# Altium schematic sheet AI_ARTIQ_Driver.SchDoc: AI ARTIQ Driver
size 420 x 297 mm; Author: G.Kasprowicz; CompanyName: CTI; Organization: CTI; Address1: CTI; Address2: Nowowiejska 15/19 00-665 Warsaw; Address3: gkasprow@gmail.com; DocumentNumber: 1; Revision: 1.0; SheetNumber: 1; SheetTotal: 11; ModifiedBy: -; CheckedDate: -; Title2: TOP; DivGrp: CTI; ModifiedDate: -; ProjectName: Sensor Box
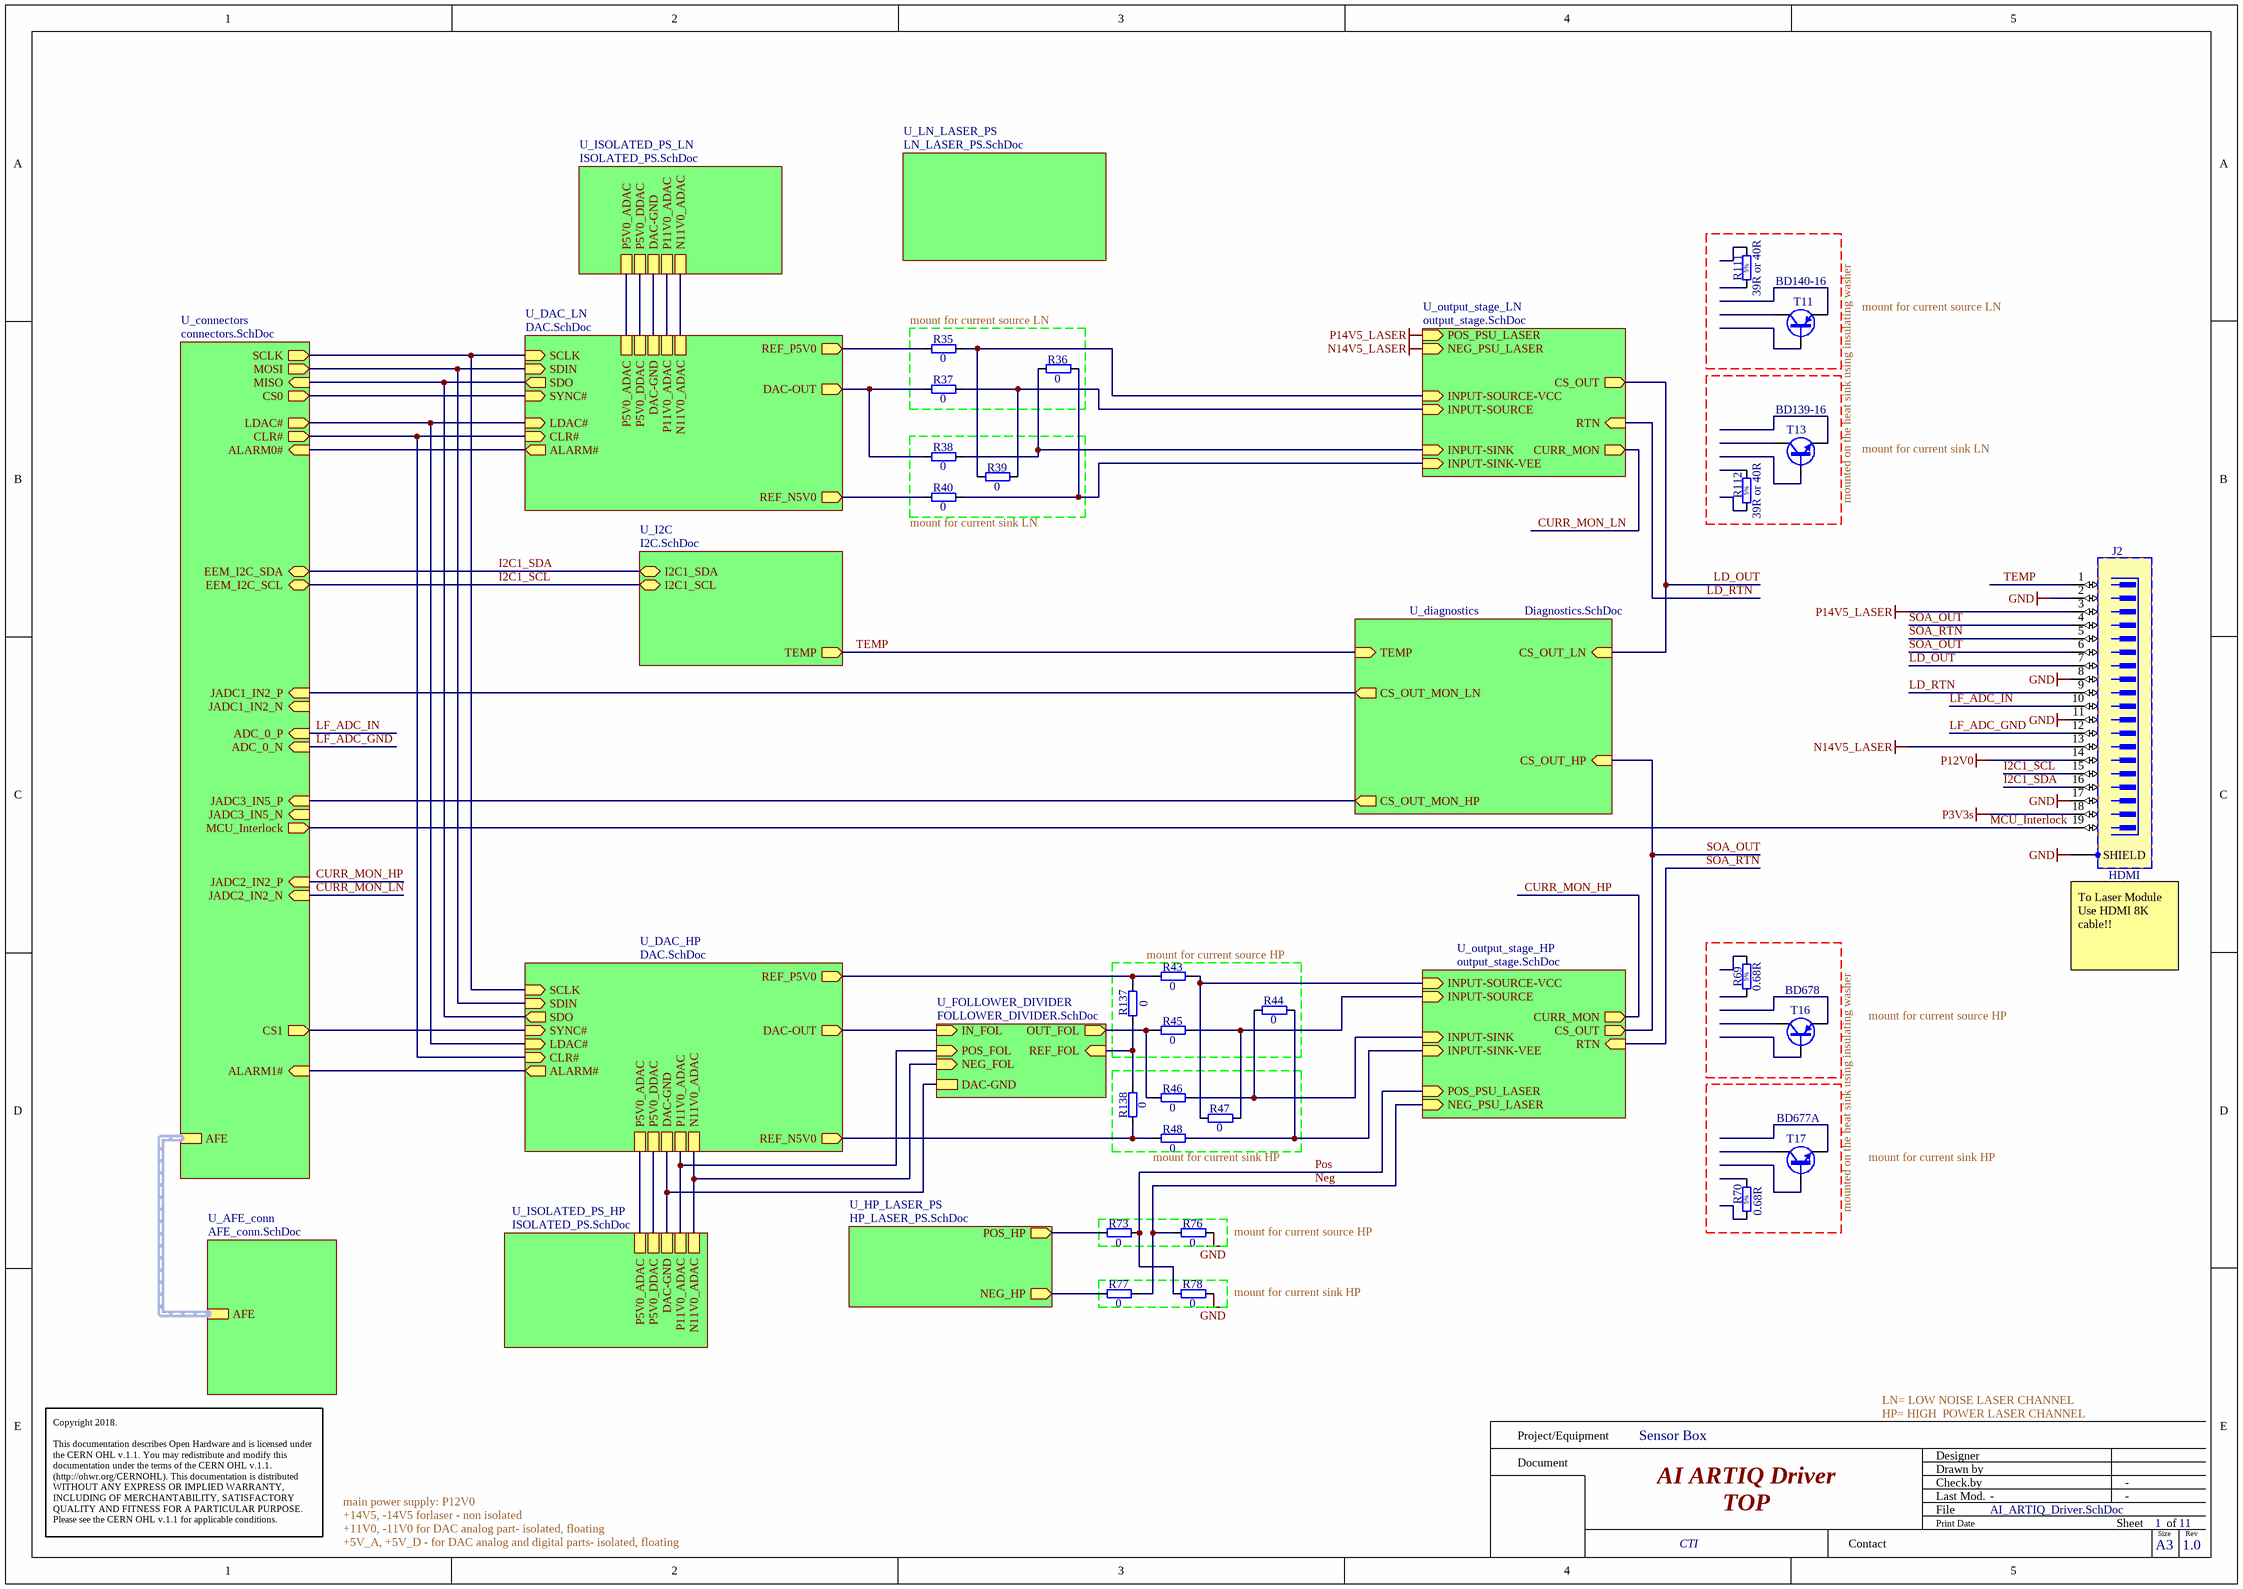
[diagram p0: AI_ARTIQ_Driver.SchDoc]

## Parts
J2  HDMI  [MOLEX_47151-0001]
R35  0  [RESC2012X60N]
R36  0  [RESC2012X60N]
R37  0  [RESC2012X60N]
R38  0  [RESC2012X60N]
R39  0  [RESC2012X60N]
R40  0  [RESC2012X60N]
R43  0  [RESC2012X60N]
R44  0  [RESC2012X60N]
R45  0  [RESC2012X60N]
R46  0  [RESC2012X60N]
R47  0  [RESC2012X60N]
R48  0  [RESC2012X60N]
R69  0.68R  [RES_VISHAY_RTO50F_v]  (mechanical)
R70  0.68R  [RES_VISHAY_RTO50F_v]  (mechanical)
R73  0  [RESC2012X60N]
R76  0  [RESC2012X60N]
R77  0  [RESC2012X60N]
R78  0  [RESC2012X60N]
R111  39R or 40R  [RES_VISHAY_RTO50F_v]  (mechanical)
R112  39R or 40R  [RES_VISHAY_RTO50F_v]  (mechanical)
R137  0  [RESC2012X60N]
R138  0  [RESC2012X60N]
T11  BD140-16  [TO-126-v]  (mechanical)
T13  BD139-16  [TO-126-v]  (mechanical)
T16  BD678  [TO-126-v]  (mechanical)
T17  BD677A  [TO-126-v]  (mechanical)

## Blocks framed on the sheet
mount for current source LN: R35-R37
mount for current source HP: R43-R45 R137

## Sub-sheets
U_AFE_conn = AFE_conn.SchDoc: AFE (harness AFE)
U_connectors = connectors.SchDoc: SCLK (out), MOSI (out), MISO (in), CS0 (out), EEM_I2C_SDA (bidir), EEM_I2C_SCL (bidir), LDAC# (out), CLR# (out), JADC1_IN2_P (in), JADC1_IN2_N (in), JADC3_IN5_P (in), JADC3_IN5_N (in), CS1 (out), ALARM0# (in), ALARM1# (in), AFE (harness AFE), ADC_0_P (in), ADC_0_N (in), MCU_Interlock (out), JADC2_IN2_P (in), JADC2_IN2_N (in)
U_DAC_HP = DAC.SchDoc: DAC-OUT (out), REF_P5V0 (out), REF_N5V0 (out), SCLK (in), SDIN (in), SYNC# (in), SDO (out), LDAC# (in), CLR# (in), ALARM# (out), P5V0_DDAC, DAC-GND, P11V0_ADAC, N11V0_ADAC, P5V0_ADAC
U_DAC_LN = DAC.SchDoc: DAC-OUT (out), REF_P5V0 (out), REF_N5V0 (out), SCLK (in), SDIN (in), SYNC# (in), SDO (out), LDAC# (in), CLR# (in), ALARM# (out), P5V0_DDAC, DAC-GND, P11V0_ADAC, N11V0_ADAC, P5V0_ADAC
U_diagnostics = Diagnostics.SchDoc: CS_OUT_HP (in), CS_OUT_MON_HP (out), CS_OUT_LN (in), CS_OUT_MON_LN (out), TEMP (in)
U_FOLLOWER_DIVIDER = FOLLOWER_DIVIDER.SchDoc: POS_FOL (in), NEG_FOL (in), IN_FOL (in), OUT_FOL (out), REF_FOL (in), DAC-GND
U_HP_LASER_PS = HP_LASER_PS.SchDoc: POS_HP (out), NEG_HP (out)
U_I2C = I2C.SchDoc: TEMP (out), I2C1_SCL (bidir), I2C1_SDA (bidir)
U_ISOLATED_PS_HP = ISOLATED_PS.SchDoc: P5V0_DDAC, DAC-GND, P11V0_ADAC, N11V0_ADAC, P5V0_ADAC
U_ISOLATED_PS_LN = ISOLATED_PS.SchDoc: P5V0_DDAC, DAC-GND, P11V0_ADAC, N11V0_ADAC, P5V0_ADAC
U_LN_LASER_PS = LN_LASER_PS.SchDoc: no entries
U_output_stage_HP = output_stage.SchDoc: INPUT-SOURCE (in), INPUT-SINK (in), INPUT-SOURCE-VCC (in), INPUT-SINK-VEE (in), CS_OUT (out), POS_PSU_LASER (in), NEG_PSU_LASER (in), RTN (in), CURR_MON (out)
U_output_stage_LN = output_stage.SchDoc: INPUT-SOURCE (in), INPUT-SINK (in), INPUT-SOURCE-VCC (in), INPUT-SINK-VEE (in), CS_OUT (out), POS_PSU_LASER (in), NEG_PSU_LASER (in), RTN (in), CURR_MON (out)

## Nets
GND: J2.2 J2.8 J2.11 J2.17 J2.SHIELD R76.2 R78.2
N14V5_LASER: J2.13 ; sheet U_output_stage_LN/NEG_PSU_LASER
P3V3s: J2.18
P12V0: J2.14
P14V5_LASER: J2.3 ; sheet U_output_stage_LN/POS_PSU_LASER
CURR_MON_HP: sheet U_connectors/JADC2_IN2_P, sheet U_output_stage_HP/CURR_MON
CURR_MON_LN: sheet U_output_stage_LN/CURR_MON, sheet U_connectors/JADC2_IN2_N
I2C1_SCL: J2.15 ; sheet U_connectors/EEM_I2C_SCL, sheet U_I2C/I2C1_SCL
I2C1_SDA: J2.16 ; sheet U_connectors/EEM_I2C_SDA, sheet U_I2C/I2C1_SDA
LD_OUT: J2.7 ; sheet U_output_stage_LN/CS_OUT, sheet U_diagnostics/CS_OUT_LN
LD_RTN: J2.9 ; sheet U_output_stage_LN/RTN
LF_ADC_GND: J2.12 ; sheet U_connectors/ADC_0_N
LF_ADC_IN: J2.10 ; sheet U_connectors/ADC_0_P
MCU_Interlock: J2.19 ; sheet U_connectors/MCU_Interlock
Neg: R76.1 R77.2 ; sheet U_output_stage_HP/NEG_PSU_LASER
Pos: R73.2 R78.1 ; sheet U_output_stage_HP/POS_PSU_LASER
SOA_OUT: J2.4 J2.6 ; sheet U_diagnostics/CS_OUT_HP, sheet U_output_stage_HP/CS_OUT
SOA_RTN: J2.5 ; sheet U_output_stage_HP/RTN
TEMP: J2.1 ; sheet U_I2C/TEMP, sheet U_diagnostics/TEMP
NetR35_1: R35.1 ; sheet U_DAC_LN/REF_P5V0
NetR35_2: R35.2 R39.1 ; sheet U_output_stage_LN/INPUT-SOURCE-VCC
NetR36_1: R36.1 R38.2 ; sheet U_output_stage_LN/INPUT-SINK
NetR36_2: R36.2 R40.2 ; sheet U_output_stage_LN/INPUT-SINK-VEE
NetR37_1: R37.1 R38.1 ; sheet U_DAC_LN/DAC-OUT
NetR37_2: R37.2 R39.2 ; sheet U_output_stage_LN/INPUT-SOURCE
NetR40_1: R40.1 ; sheet U_DAC_LN/REF_N5V0
NetR43_1: R43.1 R137.2 ; sheet U_DAC_HP/REF_P5V0
NetR43_2: R43.2 R47.1 ; sheet U_output_stage_HP/INPUT-SOURCE-VCC
NetR44_1: R44.1 R46.2 ; sheet U_output_stage_HP/INPUT-SINK
NetR44_2: R44.2 R48.2 ; sheet U_output_stage_HP/INPUT-SINK-VEE
NetR45_1: R45.1 R46.1 ; sheet U_FOLLOWER_DIVIDER/OUT_FOL
NetR45_2: R45.2 R47.2 ; sheet U_output_stage_HP/INPUT-SOURCE
NetR48_1: R48.1 R138.1 ; sheet U_DAC_HP/REF_N5V0
NetR73_1: R73.1 ; sheet U_HP_LASER_PS/POS_HP
NetR77_1: R77.1 ; sheet U_HP_LASER_PS/NEG_HP
NetR137_1: R137.1 R138.2 ; sheet U_FOLLOWER_DIVIDER/REF_FOL
(unnamed): sheet U_DAC_LN/SCLK, sheet U_connectors/SCLK, sheet U_DAC_HP/SCLK
(unnamed): sheet U_DAC_LN/SDIN, sheet U_connectors/MOSI, sheet U_DAC_HP/SDIN
(unnamed): sheet U_DAC_LN/SYNC#, sheet U_connectors/CS0
(unnamed): sheet U_DAC_LN/SDO, sheet U_connectors/MISO, sheet U_DAC_HP/SDO
(unnamed): sheet U_DAC_LN/LDAC#, sheet U_connectors/LDAC#, sheet U_DAC_HP/LDAC#
(unnamed): sheet U_DAC_LN/CLR#, sheet U_connectors/CLR#, sheet U_DAC_HP/CLR#
(unnamed): sheet U_DAC_LN/ALARM#, sheet U_connectors/ALARM0#
(unnamed): sheet U_DAC_LN/P5V0_DDAC, sheet U_ISOLATED_PS_LN/P5V0_DDAC
(unnamed): sheet U_DAC_LN/DAC-GND, sheet U_ISOLATED_PS_LN/DAC-GND
(unnamed): sheet U_DAC_LN/P11V0_ADAC, sheet U_ISOLATED_PS_LN/P11V0_ADAC
(unnamed): sheet U_DAC_LN/N11V0_ADAC, sheet U_ISOLATED_PS_LN/N11V0_ADAC
(unnamed): sheet U_DAC_LN/P5V0_ADAC, sheet U_ISOLATED_PS_LN/P5V0_ADAC
(unnamed): sheet U_connectors/JADC1_IN2_P, sheet U_diagnostics/CS_OUT_MON_LN
(unnamed): sheet U_connectors/JADC3_IN5_P, sheet U_diagnostics/CS_OUT_MON_HP
(unnamed): sheet U_connectors/CS1, sheet U_DAC_HP/SYNC#
(unnamed): sheet U_connectors/ALARM1#, sheet U_DAC_HP/ALARM#
(unnamed): sheet U_DAC_HP/DAC-OUT, sheet U_FOLLOWER_DIVIDER/IN_FOL
(unnamed): sheet U_DAC_HP/P5V0_DDAC, sheet U_ISOLATED_PS_HP/P5V0_DDAC
(unnamed): sheet U_DAC_HP/DAC-GND, sheet U_ISOLATED_PS_HP/DAC-GND, sheet U_FOLLOWER_DIVIDER/DAC-GND
(unnamed): sheet U_DAC_HP/P11V0_ADAC, sheet U_ISOLATED_PS_HP/P11V0_ADAC, sheet U_FOLLOWER_DIVIDER/POS_FOL
(unnamed): sheet U_DAC_HP/N11V0_ADAC, sheet U_ISOLATED_PS_HP/N11V0_ADAC, sheet U_FOLLOWER_DIVIDER/NEG_FOL
(unnamed): sheet U_DAC_HP/P5V0_ADAC, sheet U_ISOLATED_PS_HP/P5V0_ADAC

Not connected (* = marked no-connect by the designer): R69 1 2; R70 1 2; R111 1 2; R112 1 2; T11 1(E) 2(C) 3(B); T13 1(E) 2(C) 3(B); T16 1(E) 2(C) 3(B); T17 1(E) 2(C) 3(B)

## Buses and harness runs
harness sheet U_AFE_conn/AFE = sheet U_connectors/AFE

## Notes on the sheet
- (near T11) mount for current source LN
- (near T13) mount for current sink LN
- (near R40) mount for current sink LN
- mounted on the heat sink using insulating washer
- (near J2) To Laser Module
  Use HDMI 8K cable!!
- mount for current source HP
- (near R48) mount for current sink HP
- mount for current sink HP
- (near R76) mount for current source HP
- (near R78) mount for current sink HP
- LN= LOW NOISE LASER CHANNEL
- HP= HIGH  POWER LASER CHANNEL
- main power supply: P12V0
- +14V5, -14V5 forlaser - non isolated
- +11V0, -11V0 for DAC analog part- isolated, floating
- +5V_A, +5V_D - for DAC analog and digital parts- isolated, floating
- Project/Equipment
- Document
- Designer
- Drawn by
- Check.by
- Copyright 2018.
  This documentation describes Open Hardware and is licensed under the CERN OHL v.1.1. You may redistribute and modify this documentation under the terms of the CERN OHL v.1.1. (http://ohwr.org/CERNOHL). This documentation is distributed WITHOUT ANY EXPRESS OR IMPLIED WARRANTY, INCLUDING OF MERCHANTABILITY, SATISFACTORY QUALITY AND FITNESS FOR A PARTICULAR PURPOSE. Please see the CERN OHL v.1.1 for applicable conditions.
- Contact
- File
- Last Mod.
- Print Date
- Sheet
- Size
- A3
- of
- Rev
- (in symbol RMF_47R_5%_50W_150PPM_VISHAY_RTO50) 5%

## Library data of the parts
J2 = MOLEX_47151-0001: Connector HDMI 19 Male + 1 Shield; Part Description: 0.5mm Pitch, Surface Mount Right Angle 19 Contacts HDMI Receptacle With Thru Hole Mounting Pads; Manufacturer: MOLEX; PressFit: No; Part Number: MOLEX_47151-0001; Component Kind: Standard; Component Type: Standard; Pin Count: 20; Family: HDMI; Mounted: Yes; Socket: No; SMD: Yes; Sense: No; Status: None; Manufacturer Part Number: 47151-0001; ComponentHeight: 6.18mm; HelpURL: \\cern.ch\dfs\Applications\Altium\Datasheets\MOLEX_47151-0001.pdf; Author: CERN DEM JLC; CreateDate: 23.02.2015; LatestRevisionDate: 23.02.2015
R35-R40 R43-R48 R73 R76-R78 R137 R138 = R0805_0R_JUMPER: Resistor; Part Description: 2A (0.05R Max DC Resistance) Zero Ohm Jumper; Manufacturer: GENERIC; Manufacturer1 Part Number: NRC10Z0; PressFit: No; Part Number: R0805_0R_JUMPER; Component Kind: Standard; Component Type: Standard; Pin Count: 2; Value: 0; Status: Preferred; Manufacturer Part Number: R0805_0R_JUMPER; Case: 0805; Mounted: Yes; Sense: No; Socket: No; SMD: Yes; Manufacturer1 Example: NIC COMPONENT; Manufacturer1 ComponentHeight: 0.6mm; HelpURL: \\cern.ch\dfs\Applications\Altium\Datasheets\R0805_NIC_NRC.pdf; Author: CERN DEM JLC; CreateDate: 03.12.2007; LatestRevisionDate: 13.03.2008
R69 R70 = RMF_47R_5%_50W_150PPM_VISHAY_RTO50: Resistor - 5%; Part Description: Thick Film Power Resistor; Manufacturer: VISHAY SFERNICE; Manufacturer Part Number: RTO020FR0680JTE3; Power: 50W; TC: ±150ppm/°C; PressFit: No; Part Number: RMF_47R_5%_50W_150PPM_VISHAY_RTO50; Component Type: Standard; Pin Count: 2; Value: 0.68R; Status: None; Tolerance: ±5%; Case: TO-220; Mounted: Yes; Sense: No; Socket: No; SMD: No; ComponentHeight: 20mm; HelpURL: \\cern.ch\dfs\Applications\Altium\Datasheets\RMF_VISHAY_RTO50.pdf; Author: CERN DEM JLC; CreateDate: 21.05.2013; LatestRevisionDate: 21.05.2013
R111 R112 = RMF_47R_5%_50W_150PPM_VISHAY_RTO50: Resistor - 5%; Part Description: Thick Film Power Resistor; Manufacturer: Ohmite; Manufacturer Part Number: RH02540R00FE02; Power: 50W; TC: ±150ppm/°C; PressFit: No; Part Number: RMF_47R_5%_50W_150PPM_VISHAY_RTO50; Component Type: Standard; Pin Count: 2; Value: 39R or 40R; Status: None; Tolerance: ±5%; Case: TO-220; Mounted: Yes; Sense: No; Socket: No; SMD: No; ComponentHeight: 20mm; HelpURL: \\cern.ch\dfs\Applications\Altium\Datasheets\RMF_VISHAY_RTO50.pdf; Author: CERN DEM JLC; CreateDate: 21.05.2013; LatestRevisionDate: 21.05.2013
T11 T16 = BD140-16: PNP Transistor; Part Description: -80V -1.5A PNP Epitaxial Planar Transistor; Manufacturer: ST MICROELECTRONICS; PressFit: No; Bonding: No; Component Type: Standard; PackageDescription: TO-126 3-Terminal - Vertical Mount; Pin Count: 3; Case: TO-126; Mounted: Yes; Socket: No; SMD: No; Sense: No; ComponentHeight: 13.2mm; HelpURL: \\cern.ch\dfs\Applications\Altium\Datasheets\BD140-16.pdf; Author: CERN DEM JLC; CreateDate: 27.11.2013; LatestRevisionDate: 27.11.2013
  T11: Part Number: BD140-16; Device: BD140-16; Manufacturer Part Number: BD140-16
  T16: Part Number: BD678; Device: BD678; Manufacturer Part Number: BD678
T13 T17 = BD139-16: NPN Transistor; Part Description: 80V 1.5A NPN Epitaxial Planar Transistor; Manufacturer: ST MICROELECTRONICS; PressFit: No; Bonding: No; Component Type: Standard; PackageDescription: TO-126 3-Terminal - Vertical Mount; Pin Count: 3; Case: TO-126; Mounted: Yes; Socket: No; SMD: No; Sense: No; ComponentHeight: 13.2mm; HelpURL: \\cern.ch\dfs\Applications\Altium\Datasheets\BD139-16.pdf; Author: CERN DEM JLC; CreateDate: 27.11.2013; LatestRevisionDate: 27.11.2013
  T13: Part Number: BD139-16; Device: BD139-16; Manufacturer Part Number: BD139-16
  T17: Part Number: BD677A; Device: BD677A; Manufacturer Part Number: BD677A